# Altium schematic sheet TopLevelSch.SchDoc
size A; SheetNumber: 1; SheetTotal: 3
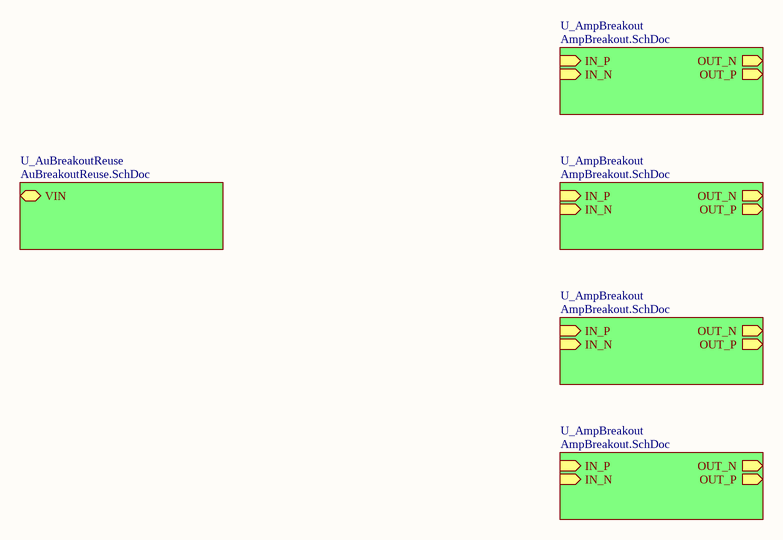
[diagram p0: TopLevelSch.SchDoc]

## Sub-sheets
U_AmpBreakout = AmpBreakout.SchDoc: OUT_N (out), OUT_P (out), IN_P (in), IN_N (in)
U_AmpBreakout = AmpBreakout.SchDoc: OUT_N (out), OUT_P (out), IN_P (in), IN_N (in)
U_AmpBreakout = AmpBreakout.SchDoc: OUT_N (out), OUT_P (out), IN_P (in), IN_N (in)
U_AmpBreakout = AmpBreakout.SchDoc: OUT_N (out), OUT_P (out), IN_P (in), IN_N (in)
U_AuBreakoutReuse = AuBreakoutReuse.SchDoc: VIN (bidir)